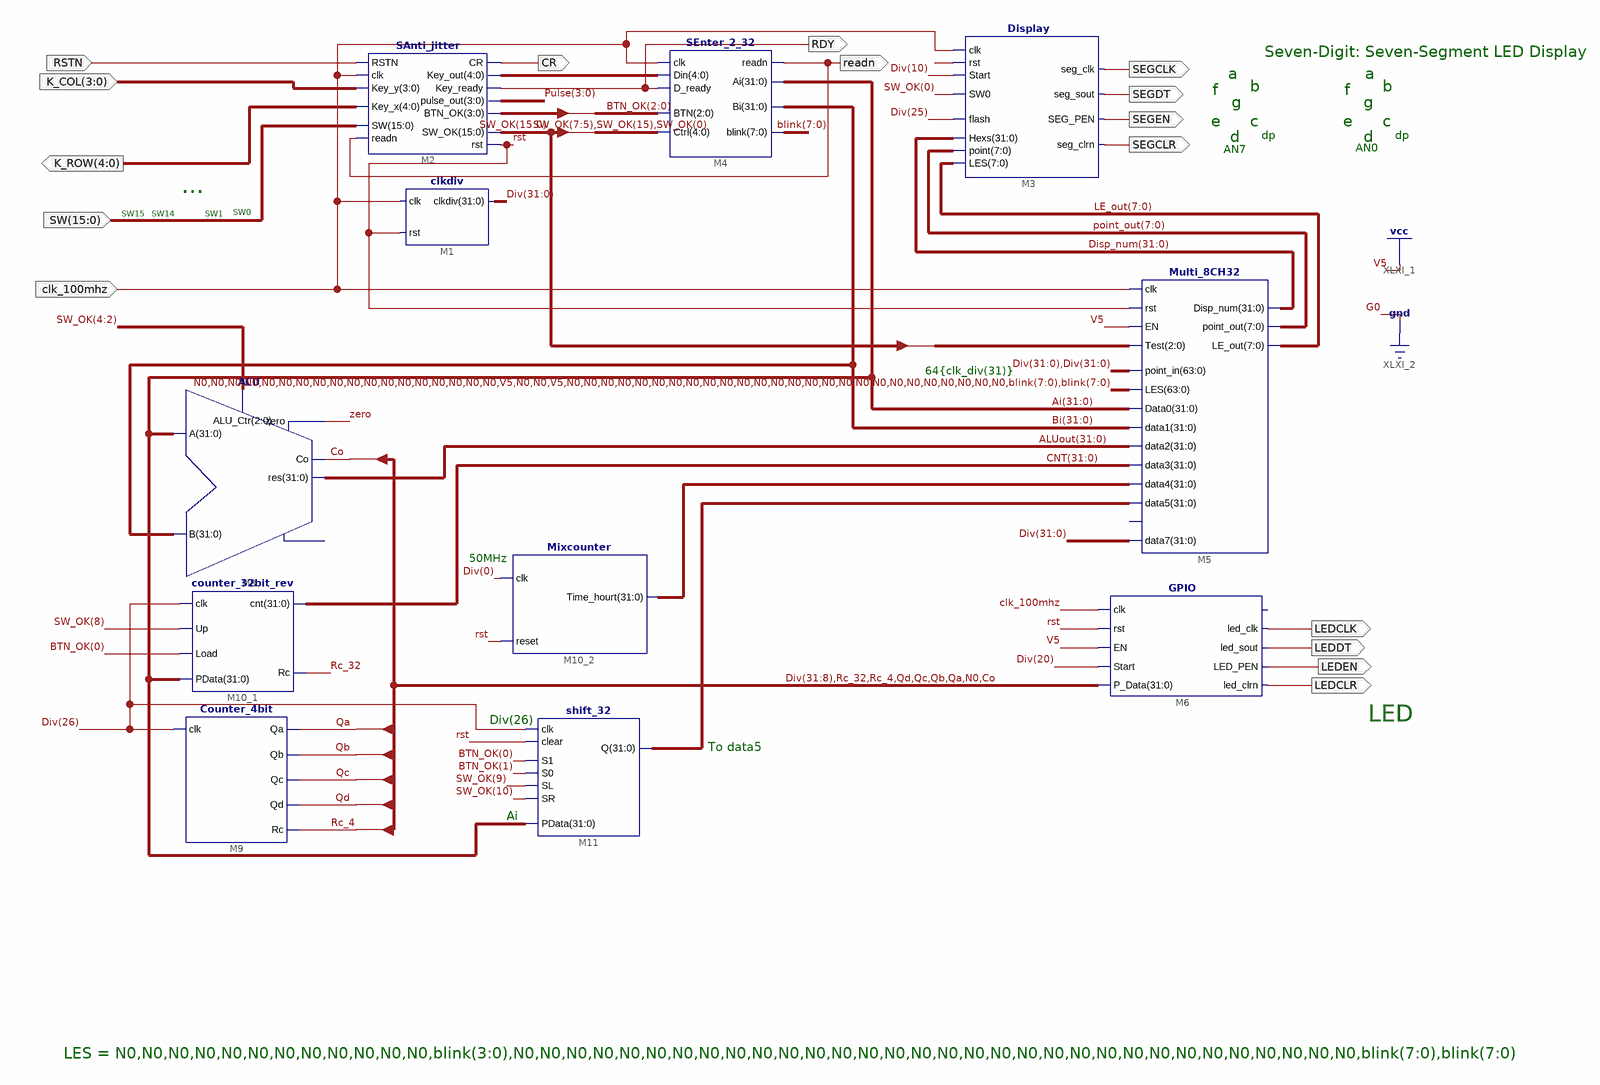
[diagram p0: schematic sheet 1]
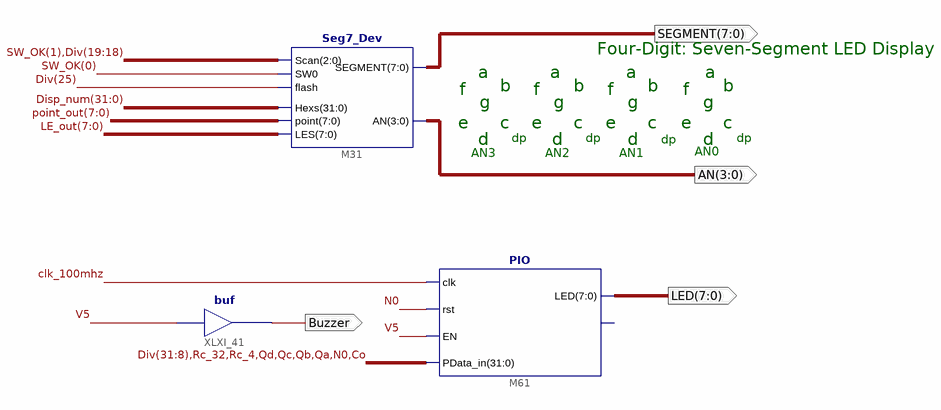
[diagram p1: schematic sheet 2]
// Xilinx ISE schematic Top_Shift.sch (kintex7) as structural Verilog: 14 symbols, 20 ports
module Top_Shift (
  input  clk_100mhz,
  input  [15:0] SW,
  input  [3:0] K_COL,
  input  RSTN,
  output readn,
  output RDY,
  output [4:0] K_ROW,
  output CR,
  output [7:0] SEGMENT,
  output [3:0] AN,
  output Buzzer,
  output [7:0] LED,
  output LEDCLR,
  output LEDEN,
  output LEDCLK,
  output LEDDT,
  output SEGCLK,
  output SEGDT,
  output SEGEN,
  output SEGCLR
);

  wire Co, N0, Qa, Qb, Qc, Qd, Rc_4, Rc_32, rst, zero;
  wire [3:0] BTN_OK, Pulse;
  wire [4:0] XLXN_444;
  wire [7:0] blink, LE_out, point_out;
  wire [15:0] SW_OK;
  wire [31:0] Ai, ALUout, Bi, CNT, Disp_num, Div, XLXN_447, XLXN_448;

  SAnti_jitter M2 (
    .SW(SW), .readn(readn), .Key_y(K_COL), .Key_x(K_ROW), .RSTN(RSTN), .clk(clk_100mhz), .Key_out(XLXN_444),
    .Key_ready(RDY), .CR(CR), .rst(rst), .SW_OK(SW_OK), .pulse_out(Pulse), .BTN_OK(BTN_OK));
  SEnter_2_32 M4 (
    .readn(readn), .Ai(Ai), .Bi(Bi), .blink(blink), .Din(XLXN_444), .D_ready(RDY), .clk(clk_100mhz),
    .Ctrl({SW_OK[7:5], SW_OK[15], SW_OK[0]}), .BTN(BTN_OK[2:0]));
  clkdiv M1 (.rst(rst), .clkdiv(Div), .clk(clk_100mhz));
  Display M3 (
    .LES(LE_out), .SEG_PEN(SEGEN), .seg_sout(SEGDT), .seg_clrn(SEGCLR), .point(point_out), .Hexs(Disp_num),
    .SW0(SW_OK[0]), .flash(Div[25]), .seg_clk(SEGCLK), .clk(clk_100mhz), .rst(rst), .Start(Div[10]));
  Seg7_Dev M31 (
    .LES(LE_out), .Scan({SW_OK[1], Div[19:18]}), .SEGMENT(SEGMENT), .AN(AN), .point(point_out),
    .flash(Div[25]), .SW0(SW_OK[0]), .Hexs(Disp_num));
  Multi_8CH32 M5 (
    .Test(SW_OK[7:5]), .point_in({Div, Div}), .EN(1'b1), .clk(clk_100mhz), .rst(rst),
    .LES({{18{N0}}, 1'b1, {2{N0}}, 1'b1, {26{N0}}, blink, blink}), .Data0(Ai), .data1(Bi), .data2(ALUout),
    .data3(CNT), .data4(XLXN_447), .data5(XLXN_448), .data7(Div), .point_out(point_out), .LE_out(LE_out),
    .Disp_num(Disp_num));  // open: data6
  PIO M61 (
    .clk(clk_100mhz), .rst(N0), .EN(1'b1), .PData_in({Div[31:8], Rc_32, Rc_4, Qd, Qc, Qb, Qa, N0, Co}),
    .LED(LED));  // open: GPIOf0
  buf XLXI_41 (Buzzer, 1'b1);
  ALU M8 (.A(Ai), .B(Bi), .res(ALUout), .zero(zero), .Co(Co), .ALU_Ctr(SW_OK[4:2]));  // open: overflow
  counter_32bit_rev M10_1 (.clk(Div[26]), .Up(SW_OK[8]), .Load(BTN_OK[0]), .Rc(Rc_32), .cnt(CNT), .PData(Ai));
  Counter_4bit M9 (.clk(Div[26]), .Qa(Qa), .Qb(Qb), .Qc(Qc), .Qd(Qd), .Rc(Rc_4));
  GPIO M6 (
    .clk(clk_100mhz), .P_Data({Div[31:8], Rc_32, Rc_4, Qd, Qc, Qb, Qa, N0, Co}), .rst(rst), .EN(1'b1),
    .Start(Div[20]), .led_clrn(LEDCLR), .led_clk(LEDCLK), .led_sout(LEDDT), .LED_PEN(LEDEN));  // open: GPIOf0
  Mixcounter M10_2 (.reset(rst), .Time_hourt(XLXN_447), .clk(Div[0]));
  shift_32 M11 (
    .Q(XLXN_448), .PData(Ai), .clk(Div[26]), .clear(rst), .S0(BTN_OK[1]), .S1(BTN_OK[0]), .SL(SW_OK[9]),
    .SR(SW_OK[10]));

  // Notes on the sheet:
  //   Seven-Digit: Seven-Segment LED Display
  //   a
  //   a
  //   b
  //   b
  //   f
  //   f
  //   g
  //   g
  //   e
  //   c
  //   e
  //   c
  //   dp
  //   dp
  //   d
  //   d
  //   AN0
  //   AN7
  //   ...
  //   SW0
  //   SW15
  //   SW14
  //   SW1
  //   64{clk_div(31)}
  //   50MHz
  //   LED
  //   Div(26)
  //   To data5
  //   Ai
  //   LES = N0,N0,N0,N0,N0,N0,N0,N0,N0,N0,N0,N0,blink(3:0),N0,N0,N0,N0,N0,N0,N0,N0,N0,N0,N0,N0,N0,N0,N0,N0,N0,N0,N0,N0,N0,N0,N0,N0,N0,N0,N0,N0,N0,N0,N0,N0,blink(7:0),blink(7:0)
  //   Four-Digit: Seven-Segment LED Display
  //   a
  //   a
  //   a
  //   a
  //   b
  //   b
  //   b
  //   b
  //   f
  //   f
  //   f
  //   f
  //   g
  //   g
  //   g
  //   g
  //   e
  //   c
  //   e
  //   c
  //   e
  //   c
  //   e
  //   c
  //   dp
  //   dp
  //   dp
  //   d
  //   d
  //   d
  //   dp
  //   d
  //   AN0
  //   AN3
  //   AN2
  //   AN1
  //   LOC on signal clk_100mhz = t9
endmodule
